# EAGLE design DRAMCarrier_250425 (EAGLE 7.7.0)
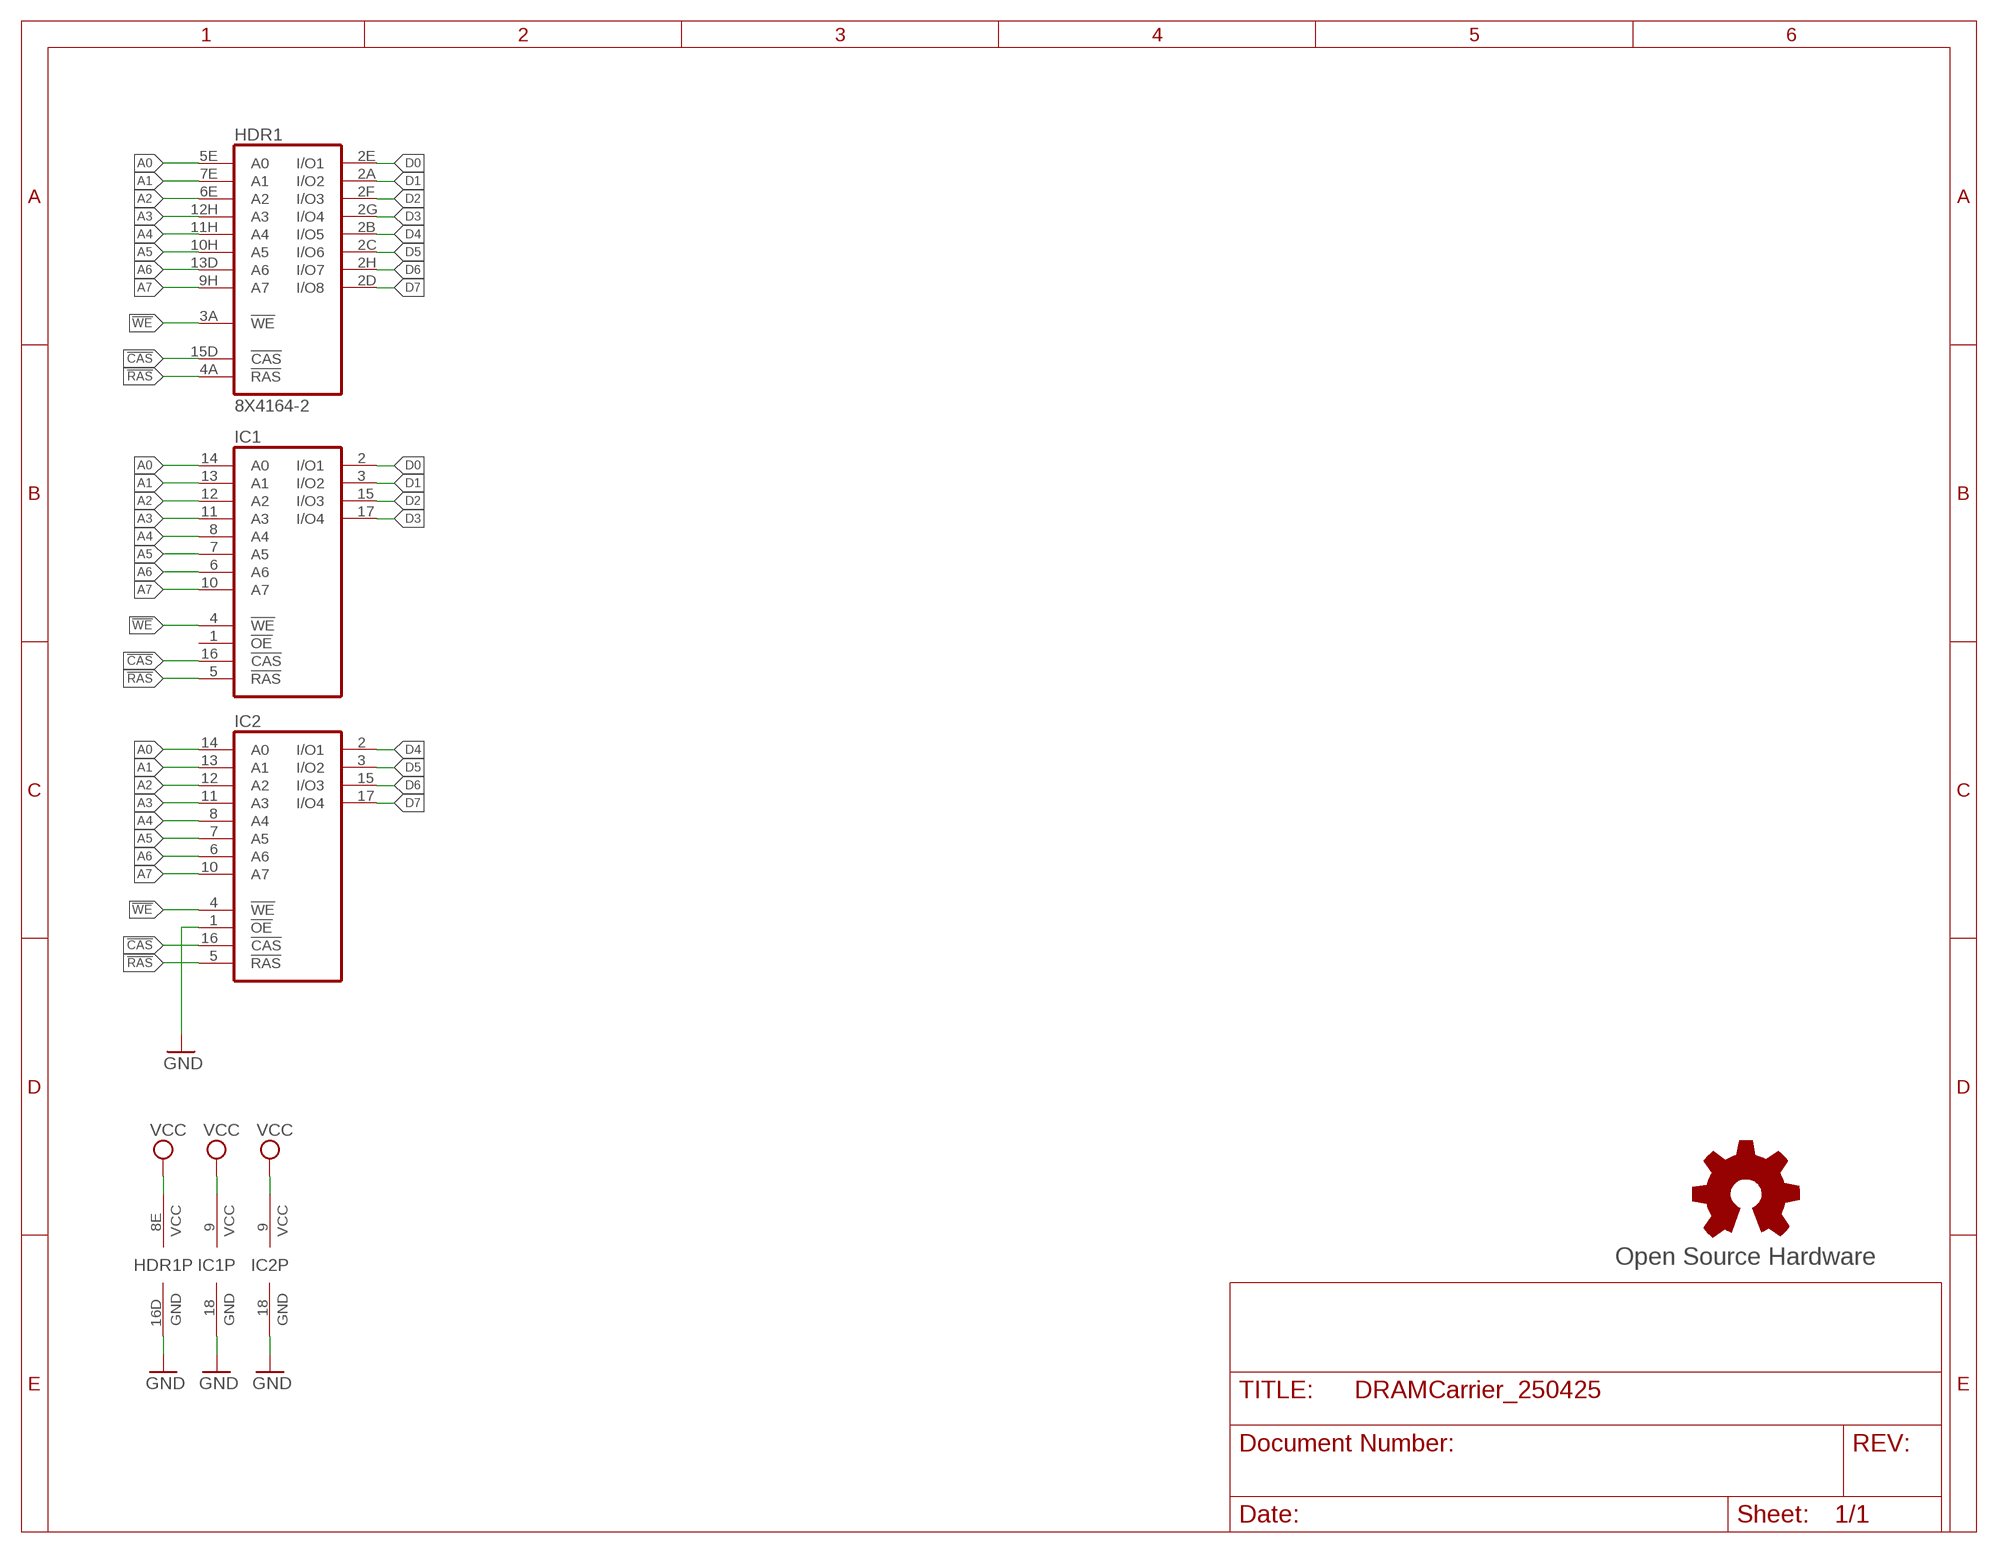
[diagram p0: schematic, sheet 1]

## Parts
GOLD_ORB_SM1  Open Source Hardware  OSHWLOGOLOGO8MM  [OSHW_8MM]
HDR1  8X4164-2  [8XDIL16_REV2]
IC1  41464C  [DIL18]
IC2  41464C  [DIL18]

## Nets
!CAS: HDR1.15D(!CAS) IC1.16(!CAS) IC2.16(!CAS)
!RAS: HDR1.4A(!RAS) IC1.5(!RAS) IC2.5(!RAS)
!WE: HDR1.3A(!WE) IC1.4(!WE) IC2.4(!WE)
A0: HDR1.5E(A0) IC1.14(A0) IC2.14(A0)
A1: HDR1.7E(A1) IC1.13(A1) IC2.13(A1)
A2: HDR1.6E(A2) IC1.12(A2) IC2.12(A2)
A3: HDR1.12H(A3) IC1.11(A3) IC2.11(A3)
A4: HDR1.11H(A4) IC1.8(A4) IC2.8(A4)
A5: HDR1.10H(A5) IC1.7(A5) IC2.7(A5)
A6: HDR1.13D(A6) IC1.6(A6) IC2.6(A6)
A7: HDR1.9H(A7) IC1.10(A7) IC2.10(A7)
D0: HDR1.2E(I/O1) IC1.2(I/O1)
D1: HDR1.2A(I/O2) IC1.3(I/O2)
D2: HDR1.2F(I/O3) IC1.15(I/O3)
D3: HDR1.2G(I/O4) IC1.17(I/O4)
D4: HDR1.2B(I/O5) IC2.2(I/O1)
D5: HDR1.2C(I/O6) IC2.3(I/O2)
D6: HDR1.2H(I/O7) IC2.15(I/O3)
D7: HDR1.2D(I/O8) IC2.17(I/O4)
GND: HDR1.16D(GND) IC1.18(GND) IC2.1(!OE) IC2.18(GND)
VCC: HDR1.8E(VCC) IC1.9(VCC) IC2.9(VCC)
Unconnected: IC1.1(!OE)

## Library data of the parts
GOLD_ORB_SM1 = oshw:OSHWLOGO: The OSHW logo for PCB layout
HDR1 = commodore:8X4164
IC1 IC2 = memory-jlb:41464C: MEMORY; OC_FARNELL: unknown; OC_NEWARK: unknown

## Board
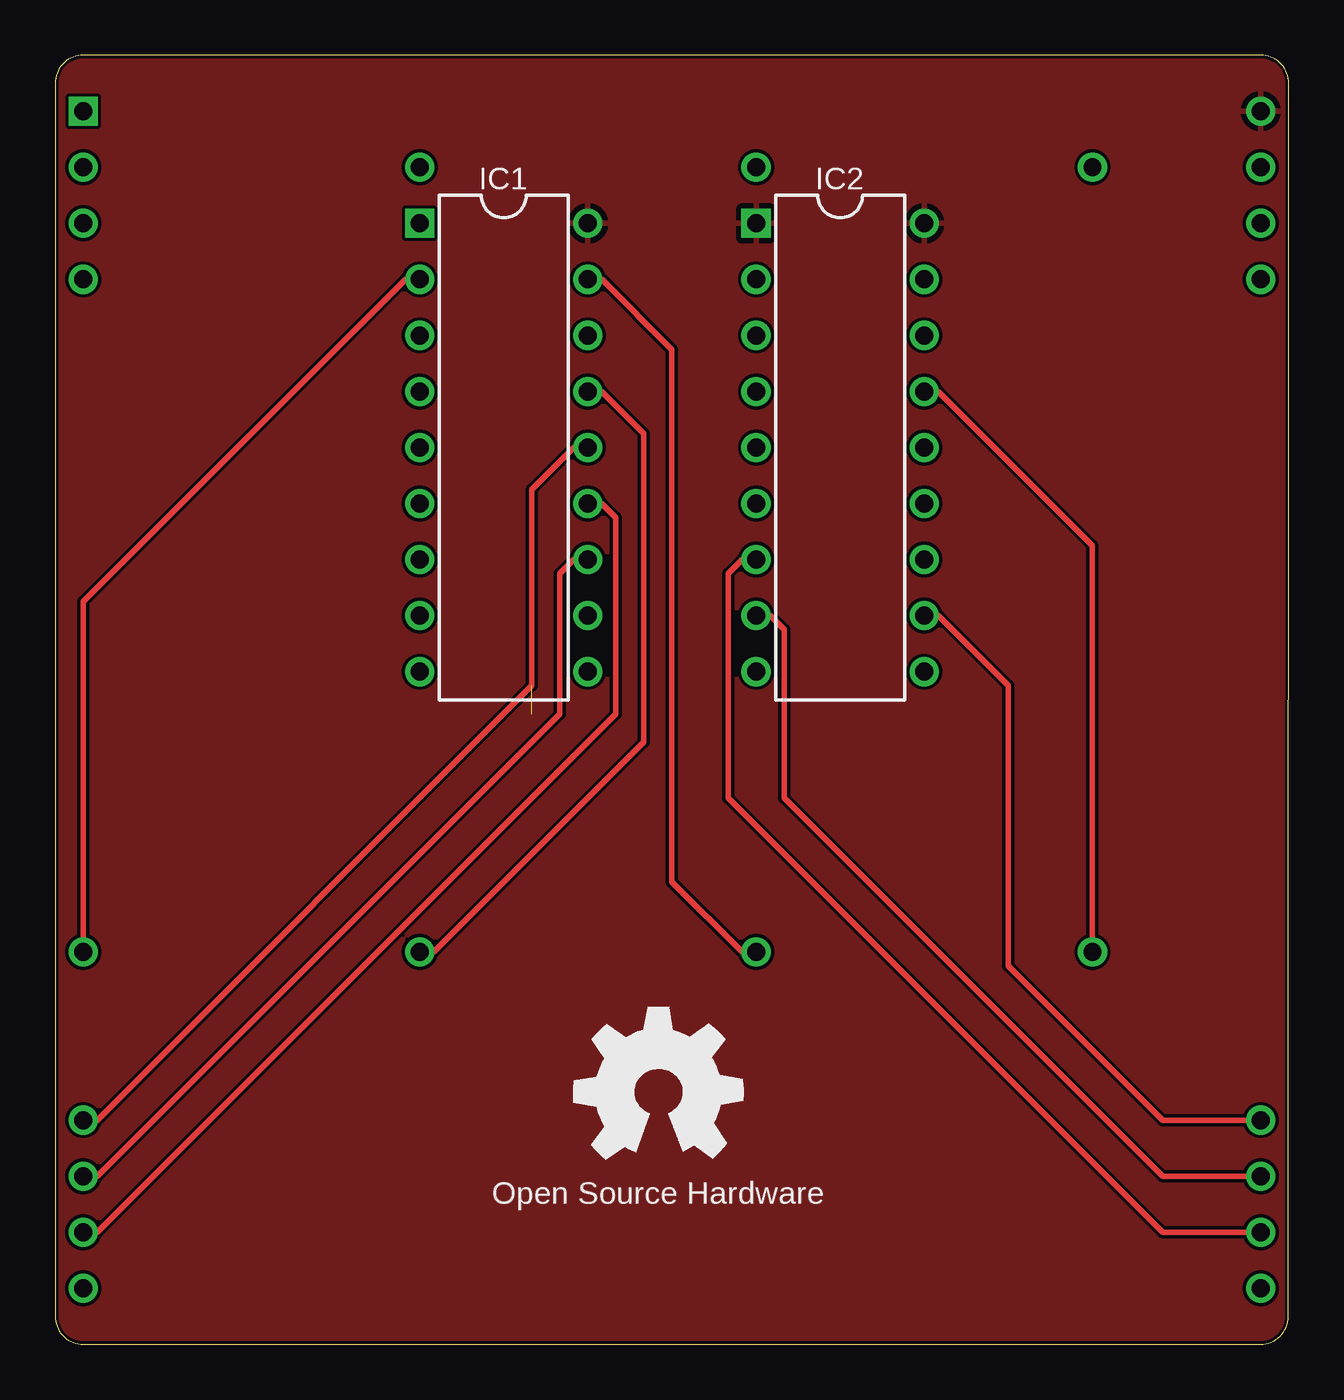
[diagram p1: board, top side]
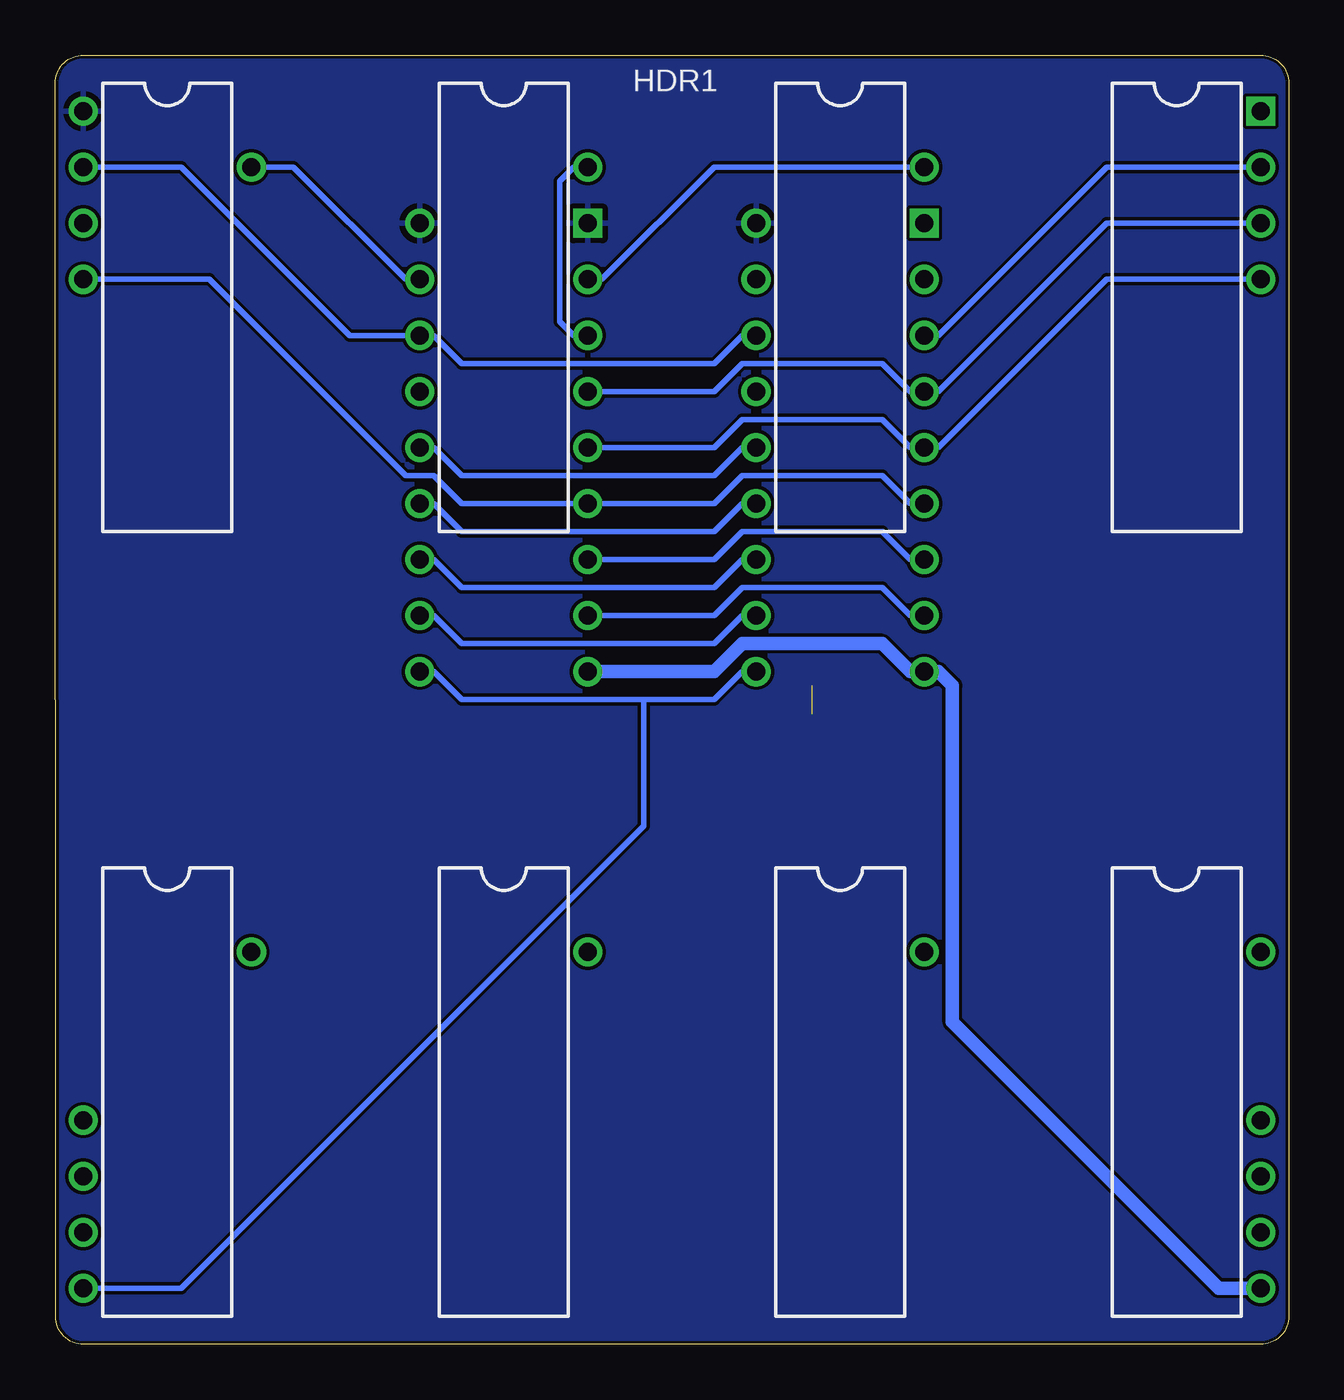
[diagram p2: board, bottom side, seen from below]

Size 55.88 x 58.42 mm. Coordinates in mm from the lower left corner, seen from the top.
Outline: 0,57.15 0,1.27 arc90 1.27,0 54.59,0 arc90 55.86,1.27 55.88,57.15 arc90 54.61,58.42 1.27,58.42 arc90 0,57.15
Copper layers (1*16): Top 0.035mm / dielectric 1.5mm / Bottom 0.035mm
Design rules "hackvana *": minimum track width 6mil, minimum drill 0.3mm, track to track 6mil, track to pad 6mil, pad to pad 6mil, via to via 6mil, smd to smd 0mil, copper to edge 6mil, drill to drill 6mil, minimum pad ring 10mil, minimum via ring 6mil, stop-mask expansion 2mil, vias tented up to drill 100mil, thermal gap 10mil

### Footprints (pad centres in the part's own frame; a part is rotated, then mirrored left to right if it is on the bottom)
8XDIL16_REV2 = drill 0.813 square: 1A -26.67,26.67 | drill 0.813: 2A -26.67,24.13; 2B -11.43,24.13; 2C 3.81,24.13; 2D 19.05,24.13; 2E -26.67,-11.43; 2F -11.43,-11.43; 2G 3.81,-11.43; 2H 19.05,-11.43; 3A -26.67,21.59; 4A -26.67,19.05; 5E -26.67,-19.05; 6E -26.67,-21.59; 7E -26.67,-24.13; 8E -26.67,-26.67; 9H 26.67,-26.67; 10H 26.67,-24.13; 11H 26.67,-21.59; 12H 26.67,-19.05; 13D 26.67,19.05; 14D 26.67,21.59; 15D 26.67,24.13; 16D 26.67,26.67
DIL18 = drill 0.813 square: 1 -10.16,-3.81 | drill 0.813: 2 -7.62,-3.81; 3 -5.08,-3.81; 4 -2.54,-3.81; 5 0,-3.81; 6 2.54,-3.81; 7 5.08,-3.81; 8 7.62,-3.81; 9 10.16,-3.81; 10 10.16,3.81; 11 7.62,3.81; 12 5.08,3.81; 13 2.54,3.81; 14 0,3.81; 15 -2.54,3.81; 16 -5.08,3.81; 17 -7.62,3.81; 18 -10.16,3.81

### Placement (x,y rotation side)
GOLD_ORB_SM1  27.3,11.43 0 top
HDR1  27.94,29.21 0 top
IC1  20.32,40.64 270 top
IC2  35.56,40.64 270 top

### Tracks (layer width: path | path; a pad name or v marks a point on that pad's centre or on a via)
!CAS
  Bottom 0.254: IC1.16 24.77,45.72 26.04,44.45 37.47,44.45 38.73,45.72 IC2.16 42.55,45.72 50.17,53.34 HDR1.15D
!RAS
  Bottom 0.254: IC2.5 26.04,40.64 24.77,41.91 18.41,41.91 17.15,40.64 IC1.5 15.88,40.64 8.26,48.26 HDR1.4A
!WE
  Bottom 0.254: HDR1.3A 8.26,50.8 15.88,43.18 IC1.4 17.15,43.18 18.41,44.45 24.77,44.45 26.04,43.18 IC2.4
A0  (1 unrouted)
  Top 0.254: HDR1.5E 1.91,10.16 21.59,29.84 21.59,38.74 23.5,40.64 IC1.14
  Bottom 0.254: IC2.14 38.73,40.64 37.47,39.37 26.04,39.37 24.77,40.64 IC1.14
A1
  Top 0.254: HDR1.7E 1.91,5.08 25.4,28.57 25.4,37.47 24.77,38.1 IC1.13
  Bottom 0.254: IC2.13 38.73,38.1 37.47,36.83 26.04,36.83 24.77,38.1 IC1.13
A2
  Top 0.254: HDR1.6E 1.91,7.62 22.86,28.57 22.86,34.93 23.5,35.56 IC1.12
  Bottom 0.254: IC2.12 38.73,35.56 37.47,34.29 26.04,34.29 24.77,35.56 IC1.12
A3
  Top 0.254: HDR1.12H 50.17,10.16 43.18,17.14 43.18,29.84 40.01,33.02 IC2.11
  Bottom 0.254: IC2.11 38.73,33.02 37.47,31.75 26.04,31.75 24.77,33.02 IC1.11
A4
  Top 0.254: HDR1.11H 50.17,7.62 33.02,24.77 33.02,32.38 32.39,33.02 IC2.8
  Bottom 0.254: IC1.8 17.15,33.02 18.41,34.29 24.77,34.29 26.04,33.02 IC2.8
A5
  Top 0.254: HDR1.10H 50.17,5.08 30.48,24.77 30.48,34.93 31.12,35.56 IC2.7
  Bottom 0.254: IC1.7 17.15,35.56 18.41,36.83 24.77,36.83 26.04,35.56 IC2.7
A6
  Bottom 0.254: IC1.6 17.15,38.1 18.41,39.37 24.77,39.37 26.04,38.1 IC2.6 37.47,38.1 38.73,39.37 40.01,39.37 48.89,48.26 HDR1.13D
A7
  Bottom 0.254: IC2.10 38.73,30.48 37.47,29.21 29.21,29.21 | IC1.10 24.77,30.48 26.04,29.21 29.21,29.21 | HDR1.9H 50.17,2.54 29.21,23.5 29.21,29.21
D0
  Top 0.254: HDR1.2E 1.27,33.66 15.88,48.26 IC1.2
D1
  Bottom 0.254: HDR1.2A 8.26,53.34 15.88,45.72 IC1.3
D2
  Top 0.254: HDR1.2F 17.15,17.78 26.67,27.3 26.67,41.28 24.77,43.18 IC1.15
D3
  Top 0.254: HDR1.2G 31.12,17.78 27.94,20.95 27.94,45.09 24.77,48.26 IC1.17
D4
  Bottom 0.254: HDR1.2B 26.04,53.34 31.12,48.26 IC2.2
D5
  Bottom 0.254: IC2.3 32.39,45.72 33.02,46.36 33.02,52.71 32.39,53.34 HDR1.2C
D6
  Top 0.254: HDR1.2H 46.99,36.2 40.01,43.18 IC2.15
D7
  Bottom 0.254: IC2.17 40.01,48.26 45.09,53.34 HDR1.2D
GND
  pour Top: 55.88,57.15 55.88,1.27 arc-90 54.61,0 1.27,0 arc-90 0,1.27 0,57.15 arc-90 1.27,58.42 54.61,58.42 arc-90
  pour Bottom: 55.88,57.15 55.88,1.27 arc-90 54.61,0 1.27,0 arc-90 0,1.27 0,57.15 arc-90 1.27,58.42 54.61,58.42 arc-90
VCC
  Bottom 0.61: HDR1.8E 3.18,2.54 15.24,14.61 15.24,29.84 15.88,30.48 IC1.9 17.15,30.48 18.41,31.75 24.77,31.75 26.04,30.48 IC2.9

### Text on the board
tValues: DRAM Carrier (250425) / (c)2019 RETRO Innovations / www.go4retro.com